# Altium schematic sheet splitter.SchDoc: Power Splitter
size Letter; CheckedBy: E. Chiu; CompanyName: Signal Laboratories, Inc.; DrawnBy: J. Brinton; Engineer: J. Brinton; Address1: 3479 Edison Way; Address2: Menlo Park CA 94025; Address3: +1 (877) 778-8435; Address4: siglabs.com; Revision: 1; SheetNumber: 10; SheetTotal: 44
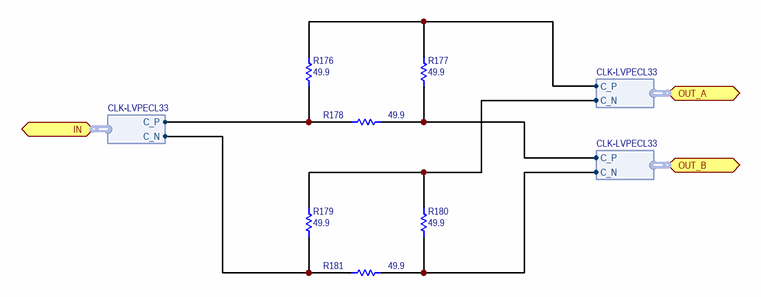
[diagram p0: splitter.SchDoc]

## Parts
R176  value 49.9  [0402]  (hidden comment: ERA-2AEB49R9X)
R177  value 49.9  [0402]  (hidden comment: ERA-2AEB49R9X)
R178  value 49.9  [0402]  (hidden comment: ERA-2AEB49R9X)
R179  value 49.9  [0402]  (hidden comment: ERA-2AEB49R9X)
R180  value 49.9  [0402]  (hidden comment: ERA-2AEB49R9X)
R181  value 49.9  [0402]  (hidden comment: ERA-2AEB49R9X)

## Ports
IN (harness CLK-LVPECL33), OUT_A (harness CLK-LVPECL33), OUT_B (harness CLK-LVPECL33)

## Harnesses
CLK-LVPECL33: C_P, C_N

## Nets
NetR176_1: R176.1 R177.1 ; port OUT_A.C_P
NetR176_2: R176.2 R178.2 ; port IN.C_P
NetR177_2: R177.2 R178.1 ; port OUT_B.C_P
NetR179_1: R179.1 R180.1 ; port OUT_A.C_N
NetR179_2: R179.2 R181.2 ; port IN.C_N
NetR180_2: R180.2 R181.1 ; port OUT_B.C_N

## Notes on the sheet
- Title
- Engineer
- Revision
- Drawn By
- Checked By
- Date
- Sheet
- of

## Library data of the parts
R176-R181 = RES 0402: Thin Film Resistor 49.9 ±0.1% 0402; Manufacturer: Panasonic; Tr: -55:155; Package: 0402; Manufacturer P/N: ERA-2AEB49R9X; Tolerance: ±0.1%